# Altium project Project Board Test SOM AM625.PrjPcb (part 6 of 7)

## Sheet JTAG & DEBUG & HEADERS.SchDoc
size A3; DocumentNumber: 10; SheetNumber: 10; SheetTotal: 12
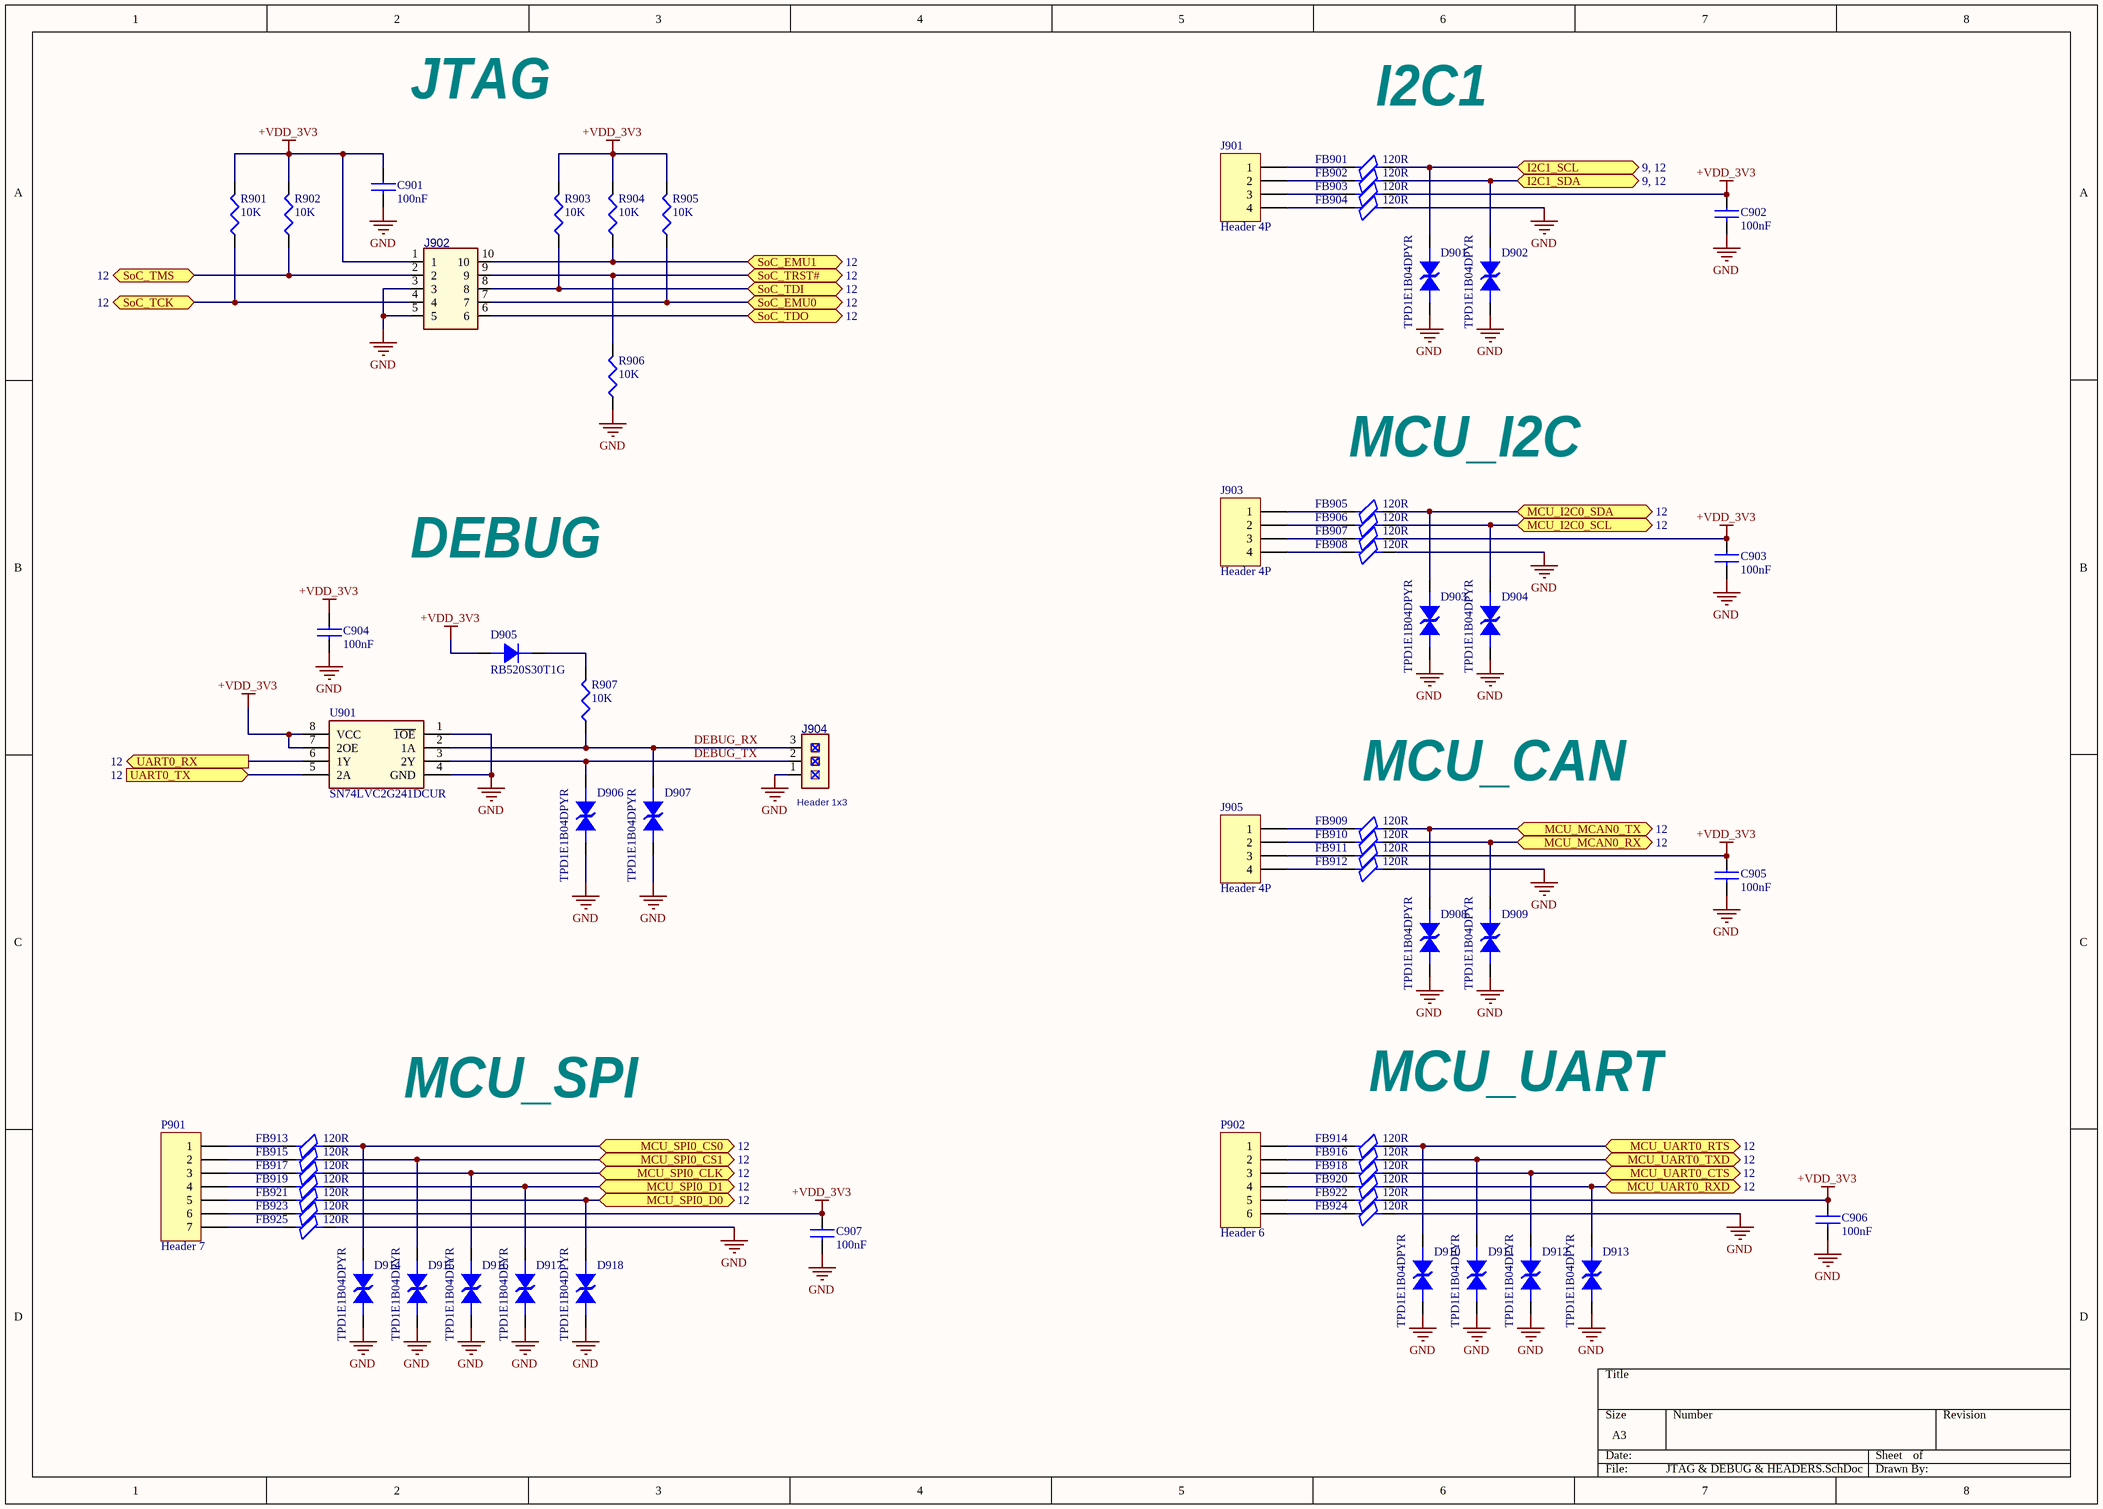
[diagram p6: JTAG & DEBUG & HEADERS.SchDoc]

### Parts
C901  100nF  [C0201]
C902  100nF  [C0201]
C903  100nF  [C0201]
C904  100nF  [C0201]
C905  100nF  [C0201]
C906  100nF  [C0201]
C907  100nF  [C0201]
D901  TPD1E1B04DPYR  [DIO_TPD1E05U06DPYR]
D902  TPD1E1B04DPYR  [DIO_TPD1E05U06DPYR]
D903  TPD1E1B04DPYR  [DIO_TPD1E05U06DPYR]
D904  TPD1E1B04DPYR  [DIO_TPD1E05U06DPYR]
D905  RB520S30T1G  [sod_523]
D906  TPD1E1B04DPYR  [DIO_TPD1E05U06DPYR]
D907  TPD1E1B04DPYR  [DIO_TPD1E05U06DPYR]
D908  TPD1E1B04DPYR  [DIO_TPD1E05U06DPYR]
D909  TPD1E1B04DPYR  [DIO_TPD1E05U06DPYR]
D910  TPD1E1B04DPYR  [DIO_TPD1E05U06DPYR]
D911  TPD1E1B04DPYR  [DIO_TPD1E05U06DPYR]
D912  TPD1E1B04DPYR  [DIO_TPD1E05U06DPYR]
D913  TPD1E1B04DPYR  [DIO_TPD1E05U06DPYR]
D914  TPD1E1B04DPYR  [DIO_TPD1E05U06DPYR]
D915  TPD1E1B04DPYR  [DIO_TPD1E05U06DPYR]
D916  TPD1E1B04DPYR  [DIO_TPD1E05U06DPYR]
D917  TPD1E1B04DPYR  [DIO_TPD1E05U06DPYR]
D918  TPD1E1B04DPYR  [DIO_TPD1E05U06DPYR]
FB901  120R  [FB0402]
FB902  120R  [FB0402]
FB903  120R  [FB0402]
FB904  120R  [FB0402]
FB905  120R  [FB0402]
FB906  120R  [FB0402]
FB907  120R  [FB0402]
FB908  120R  [FB0402]
FB909  120R  [FB0402]
FB910  120R  [FB0402]
FB911  120R  [FB0402]
FB912  120R  [FB0402]
FB913  120R  [FB0402]
FB914  120R  [FB0402]
FB915  120R  [FB0402]
FB916  120R  [FB0402]
FB917  120R  [FB0402]
FB918  120R  [FB0402]
FB919  120R  [FB0402]
FB920  120R  [FB0402]
FB921  120R  [FB0402]
FB922  120R  [FB0402]
FB923  120R  [FB0402]
FB924  120R  [FB0402]
FB925  120R  [FB0402]
J901  Header 4P  [HDR1X4]
J902  Header 2X5_1  [CONNECT10_1D27_12_4X6_7MM]  (value not drawn)
J903  Header 4P  [HDR1X4]
J904  Header 1x3  [HDR1X3]
J905  Header 4P  [HDR1X4]
P901  Header 7  [HDR1X7]
P902  Header 6  [HDR1X6]
R901  10K  [R0402]
R902  10K  [R0402]
R903  10K  [R0402]
R904  10K  [R0402]
R905  10K  [R0402]
R906  10K  [R0402]
R907  10K  [R0402]
U901  SN74LVC2G241DCUR  [DCU8-M]

### Ports
I2C1_SCL (bidir, see 9, 12), I2C1_SDA (bidir, see 9, 12), MCU_I2C0_SCL (bidir, see 12), MCU_I2C0_SDA (bidir, see 12), MCU_MCAN0_RX (bidir, see 12), MCU_MCAN0_TX (bidir, see 12), MCU_SPI0_CLK (bidir, see 12), MCU_SPI0_CS0 (bidir, see 12), MCU_SPI0_CS1 (bidir, see 12), MCU_SPI0_D0 (bidir, see 12), MCU_SPI0_D1 (bidir, see 12), MCU_UART0_CTS (bidir, see 12), MCU_UART0_RTS (bidir, see 12), MCU_UART0_RXD (bidir, see 12), MCU_UART0_TXD (bidir, see 12), SoC_EMU0 (bidir, see 12), SoC_EMU1 (bidir, see 12), SoC_TCK (bidir, see 12), SoC_TDI (bidir, see 12), SoC_TDO (bidir, see 12), SoC_TMS (bidir, see 12), SoC_TRST# (bidir, see 12), UART0_RX (out, see 12), UART0_TX (in, see 12)

### Nets
+VDD_3V3: C901.1 C902.1 C903.1 C904.1 C905.1 C906.1 C907.1 D905.1(A) FB903.2 FB907.2 FB911.2 FB922.2 FB923.2 J902.1 R901.2 R902.2 R903.2 R904.2 R905.2 U901.7(2OE) U901.8(VCC)
GND: C901.2 C902.2 C903.2 C904.2 C905.2 C906.2 C907.2 D901.1 D902.1 D903.1 D904.1 D906.1 D907.1 D908.1 D909.1 D910.1 D911.1 D912.1 D913.1 D914.1 D915.1 D916.1 D917.1 D918.1 FB904.2 FB908.2 FB912.2 FB924.2 FB925.2 J902.3 J902.5 J904.1 R906.1 U901.1(~{1OE}) U901.4(GND)
DEBUG_RX: D907.2 J904.3 R907.1 U901.2(1A)
DEBUG_TX: D906.2 J904.2 U901.3(2Y)
I2C1_SCL: D901.2 FB901.2 ; port I2C1_SCL
I2C1_SDA: D902.2 FB902.2 ; port I2C1_SDA
MCU_I2C0_SCL: D904.2 FB906.2 ; port MCU_I2C0_SCL
MCU_I2C0_SDA: D903.2 FB905.2 ; port MCU_I2C0_SDA
MCU_MCAN0_RX: D909.2 FB910.2 ; port MCU_MCAN0_RX
MCU_MCAN0_TX: D908.2 FB909.2 ; port MCU_MCAN0_TX
MCU_SPI0_CLK: D916.2 FB917.2 ; port MCU_SPI0_CLK
MCU_SPI0_CS0: D914.2 FB913.2 ; port MCU_SPI0_CS0
MCU_SPI0_CS1: D915.2 FB915.2 ; port MCU_SPI0_CS1
MCU_SPI0_D0: D918.2 FB921.2 ; port MCU_SPI0_D0
MCU_SPI0_D1: D917.2 FB919.2 ; port MCU_SPI0_D1
MCU_UART0_CTS: D912.2 FB918.2 ; port MCU_UART0_CTS
MCU_UART0_RTS: D910.2 FB914.2 ; port MCU_UART0_RTS
MCU_UART0_RXD: D913.2 FB920.2 ; port MCU_UART0_RXD
MCU_UART0_TXD: D911.2 FB916.2 ; port MCU_UART0_TXD
SoC_EMU0: J902.7 R905.1 ; port SoC_EMU0
SoC_EMU1: J902.10 R904.1 ; port SoC_EMU1
SoC_TCK: J902.4 R901.1 ; port SoC_TCK
SoC_TDI: J902.8 R903.1 ; port SoC_TDI
SoC_TDO: J902.6 ; port SoC_TDO
SoC_TMS: J902.2 R902.1 ; port SoC_TMS
SoC_TRST#: J902.9 R906.2 ; port SoC_TRST#
UART0_RX: U901.6(1Y) ; port UART0_RX
UART0_TX: U901.5(2A) ; port UART0_TX
NetD905_2: D905.2(C) R907.2
NetFB901_1: FB901.1 J901.1
NetFB902_1: FB902.1 J901.2
NetFB903_1: FB903.1 J901.3
NetFB904_1: FB904.1 J901.4
NetFB905_1: FB905.1 J903.1
NetFB906_1: FB906.1 J903.2
NetFB907_1: FB907.1 J903.3
NetFB908_1: FB908.1 J903.4
NetFB909_1: FB909.1 J905.1
NetFB910_1: FB910.1 J905.2
NetFB911_1: FB911.1 J905.3
NetFB912_1: FB912.1 J905.4
NetFB913_1: FB913.1 P901.1
NetFB914_1: FB914.1 P902.1
NetFB915_1: FB915.1 P901.2
NetFB916_1: FB916.1 P902.2
NetFB917_1: FB917.1 P901.3
NetFB918_1: FB918.1 P902.3
NetFB919_1: FB919.1 P901.4
NetFB920_1: FB920.1 P902.4
NetFB921_1: FB921.1 P901.5
NetFB922_1: FB922.1 P902.5
NetFB923_1: FB923.1 P901.6
NetFB924_1: FB924.1 P902.6
NetFB925_1: FB925.1 P901.7

### Notes on the sheet
- JTAG
- I2C1
- MCU_I2C
- DEBUG
- MCU_CAN
- MCU_SPI
- MCU_UART

### Library data of the parts
C901-C907 = CC0201KRX5R6BB104: as C312-C317 on sheet HDMI; Supplier 1: Future Electronics; Manufacturer Part Number: CC0201KRX5R6BB104; RoHS: Yes; Category: Ceramic Capacitors; Stock 1: 10410000; Pricing 1: 15000=0.0027, 60000=0.0026, 150000=0.0025, 375000=0.0024, 600000=0.0023 (USD); Mount: Surface Mount; Case/Package: 0201; Case Code (Imperial): 0201; Case Code (Metric): 0603; Weight: 6E-06oz; Min Operating Temperature: -55°C; Max Operating Temperature: 85°C; Capacitance: 100nF; Tolerance: 10%; Dielectric: X5R; Packaging: Tape and Reel; Termination: SMD/SMT; Voltage Rating: 10V; Series: CC; Construction: Flat; Length: 0.6mm; Height: 0.3mm; Depth: 0.3mm; Radiation Hardening: No; RoHS Compliant: Yes; Halogen Free: 5694HalogenFree; Lead Free: 5697LeadFree; ComponentLink1URL: https://datasheet.ciiva.com/11587/upy-gphc-x5r-4v-to-50v-12-11587190.pdf?src-supplier=Avnet; ComponentLink1Description: https://datasheet.ciiva.com/11587/upy-gphc-x5r-4v-to-50v-12-11587190.pdf?src-supplier=Avnet; Supplier Part Number 1: 5050553
D901-D904 D906-D918 = TPD1E1B04DPYR: 1-pF, ±3.6-V, ±30-kV ESD protection diode with 6-A 8/20-uS surge & Low Clamping in 0402 package; Manufacturer: Texas Instruments; Capacitance: 1pF; Interface: LVDS,USB,Ethernet; Number of Channels: 1; Direction: 211Direction; Breakdown Voltage: 6.4V; Clamping Voltage: 8.5V; Peak Pulse Current: 6.3A; Peak Pulse Power: 50W; Reverse Standoff Voltage: 3.6V; Supplier 1: Mouser; Manufacturer Part Number: TPD1E1B04DPYR; RoHS: Yes; Category: Integrated Circuits (ICs); Stock 1: 57724; Pricing 1: 1=0.35, 10=0.28, 50=0.28, 100=0.184, 500=0.144, 1000=0.102, 2500=0.098, 10000=0.085, 20000=0.084, 50000=0.079 (USD); Number of Pins: 2NUMBER; Min Operating Temperature: -40°C; Max Operating Temperature: 125°C; Length: 600um; Width: 1mm; Height: 450um; Thickness: 370um; Lead Free: Lead Free; RoHS Compliant: Yes; ComponentLink1URL: http://www.ti.com/lit/ds/symlink/tpd1e1b04.pdf?src-supplier=Digi-Key; ComponentLink1Description: http://www.ti.com/lit/ds/symlink/tpd1e1b04.pdf?src-supplier=Digi-Key; ComponentLink2URL: http://www.ti.com/general/docs/suppproductinfo.tsp?distId=10&amp;gotoUrl=http%3A%2F%2Fwww.ti.com%2Flit%2Fgpn%2Ftpd1e1b04&src-supplier=Digi-Key; ComponentLink2Description: http://www.ti.com/general/docs/suppproductinfo.tsp?distId=10&amp;gotoUrl=http%3A%2F%2Fwww.ti.com%2Flit%2Fgpn%2Ftpd1e1b04&src-supplier=Digi-Key; Supplier Part Number 1: 595-TPD1E1B04DPYR
D905 = RB520S30T1G: Diode Schottky 30V 0.2A 2-Pin SOD-523 T/R - Product that comes on tape, but is not reeled; Manufacturer: ON Semiconductor; Polarity: Standard; Current Rating: 200mA; Element Configuration: Single; Forward Voltage: 600mV; Max Reverse Leakage Current: 1uA; Power Dissipation: 200mW; Supplier 1: Future Electronics; Manufacturer Part Number: RB520S30T1G; RoHS: Yes; Category: Schottky Diodes; Stock 1: 33000; Pricing 1: 3000=0.0155, 12000=0.0148, 45000=0.0143, 90000=0.0139, 225000=0.0133 (USD); Case/Package: SOD-523-2; Number of Pins: 2; Min Operating Temperature: -55°C; Max Operating Temperature: 150°C; Packaging: Tape and Reel; Voltage Rating (DC): 30V; Output Current: 200mA; Max Repetitive Reverse Voltage (Vrrm): 30V; Package Quantity: 3000; Forward Current: 200mA; Average Rectified Current: 200mA; Max Forward Surge Current (Ifsm): 200mA; Max Reverse Current: 1uA; Max Reverse Voltage (DC): 30V; Series: -; Length: 1.3mm; Width: 0.9mm; Height: 0.7mm; Radiation Hardening: No; Reach SVHC Compliant: No; Lead Free: Lead Free; RoHS Compliant: Yes; ComponentLink1URL: https://datasheet.ciiva.com/915/rb520s30t1-d-915377.pdf?src-supplier=Avnet; ComponentLink1Description: https://datasheet.ciiva.com/915/rb520s30t1-d-915377.pdf?src-supplier=Avnet; ComponentLink2URL: https://datasheet.ciiva.com/915/rb520s30t1-d-915377.pdf?src-supplier=Digi-Key; ComponentLink2Description: https://datasheet.ciiva.com/915/rb520s30t1-d-915377.pdf?src-supplier=Digi-Key; ComponentLink3URL: https://datasheet.ciiva.com/22659/1708342-22659126.pdf?src-supplier=Element14; ComponentLink3Description: https://datasheet.ciiva.com/22659/1708342-22659126.pdf?src-supplier=Element14; ComponentLink4URL: https://datasheet.ciiva.com/4715/rb520s30t1-d-101117-4715113.pdf?src-supplier=Mouser; ComponentLink4Description: https://datasheet.ciiva.com/4715/rb520s30t1-d-101117-4715113.pdf?src-supplier=Mouser; ComponentLink5URL: https://datasheet.ciiva.com/16210/rb520s30t1-d-16210917.pdf?src-supplier=Future+Electronics; ComponentLink5Description: https://datasheet.ciiva.com/16210/rb520s30t1-d-16210917.pdf?src-supplier=Future+Electronics; ComponentLink6URL: https://datasheet.ciiva.com/8292/rb520s30t1-d-8292399.pdf?src-supplier=Avnet; ComponentLink6Description: https://datasheet.ciiva.com/8292/rb520s30t1-d-8292399.pdf?src-supplier=Avnet; ComponentLink7URL: https://datasheet.ciiva.com/915/rb520s30t1-d-915378.pdf?src-supplier=Digi-Key; ComponentLink7Description: https://datasheet.ciiva.com/915/rb520s30t1-d-915378.pdf?src-supplier=Digi-Key; ComponentLink8URL: https://datasheet.ciiva.com/915/rb520s30t1-d-915379.pdf?src-supplier=Digi-Key; ComponentLink8Description: https://datasheet.ciiva.com/915/rb520s30t1-d-915379.pdf?src-supplier=Digi-Key; Supplier Part Number 1: 7657109
FB901-FB925 = BLM15PD121SZ1D: as FB301-FB306 on sheet HDMI; Supplier 1: Arrow Electronics; Manufacturer Part Number: BLM15PD121SZ1D; RoHS: Yes; Category: Ferrite Beads and Chips; Stock 1: 10000; Pricing 1: 10000=0.0178, 20000=0.0168, 30000=0.016, 50000=0.0158 (USD); Mount: Surface Mount; Case/Package: 0402; Case Code (Imperial): 0402; Case Code (Metric): 1005; Min Operating Temperature: -55°C; Max Operating Temperature: 125°C; Packaging: Cut Tape; Max Current Rating: 1.3A; Series: EMIFIL®, BLM15; RMS Current (Irms): 1.3A; Series Resistance: 90mR; Test Frequency: 100MHz; Tolerance: 25%; Height: 550um; Ratings: AEC-Q200; RoHS Compliant: Yes; ComponentLink1URL: https://www.murata.com/en-us/products/productdata/8796748677150/QNFA9118.pdf?src-supplier=Digi-Key; ComponentLink1Description: https://www.murata.com/en-us/products/productdata/8796748677150/QNFA9118.pdf?src-supplier=Digi-Key; Supplier Part Number 1: BLM15PD121SZ1D
J901 J903 J905 = Header 4x1: Header, 4 Pin Pitch 2.54mm; MPN: S1012EC-40-ND; CompanyID: VT-00125; Solder: WAVE; Value: Header 4P
P901 = Header 7x1: Header, 7-Pin, 2.54mm; Solder: WAVE
P902 = Header 6x1: Header, 6-Pin; Solder: WAVE
R901-R907 = RC0402FR-0710KL: RES 10.0K OHM 1/16W 1% 0402 SMD; Manufacturer: Yageo; Power (Watts): 0.063W, 1/16W; .Checked PCB: used; Temperature Coefficient: ±100ppm/°C; Category: Resistors; Supplier Part Number: 311-10.0KLRCT-ND; Manufacturer Part Number: RC0402FR-0710KL; Package / Case: 0402 (1005 Metric); Price 1k [$]: 0.01421; Resistance (Ohms): 10K; Tolerance: ±1%; Value: 10k; .Checked SCH: used; Supplier: Digikey; Supplier 1: Digi-Key; Supplier Part Number 1: 311-10.0KLRCT-ND; RoHS: RoHS Compliant; Stock 1: 2916495; Pricing 1: 10=0.014, 50=0.0104, 100=0.0079, 250=0.00584, 500=0.00432, 1000=0.00288 (USD); Composition: Thick Film; Features: -; Size / Dimension: 0.039" L x 0.020" W (1.00mm x 0.50mm); Height: 0.016" (0.40mm); Number of Terminations: 2; Packaging: Cut Tape (CT); ComponentLink1URL: http://www.yageo.com/documents/recent/PYu-RC0402_51_RoHS_L_6.pdf; ComponentLink1Description: http://www.yageo.com/documents/recent/PYu-RC0402_51_RoHS_L_6.pdf
U901 = SN74LVC2G241DCUR: Buffer, Non-Inverting 2 Element 1 Bit per Element Push-Pull Output US8; Manufacturer: Texas Instruments; Supplier 1: Mouser; Manufacturer Part Number: SN74LVC2G241DCUR; RoHS: Yes; Category: Buffers, Drivers and Transceivers; Stock 1: 7164; Pricing 1: 1=0.57, 10=0.473, 50=0.473, 100=0.355, 1000=0.23, 10000=0.182 (USD); ComponentLink1URL: https://datasheet.ciiva.com/15095/getdatasheetpartid-196853-15095029.pdf?src-supplier=Verical; ComponentLink1Description: https://datasheet.ciiva.com/15095/getdatasheetpartid-196853-15095029.pdf?src-supplier=Verical; ComponentLink2URL: https://datasheet.ciiva.com/1833/sn74lvc2g241-1833955.pdf?src-supplier=Digi-Key; ComponentLink2Description: https://datasheet.ciiva.com/1833/sn74lvc2g241-1833955.pdf?src-supplier=Digi-Key; ComponentLink3URL: https://datasheet.ciiva.com/1833/sn74lvc2g241-1833956.pdf?src-supplier=Digi-Key; ComponentLink3Description: https://datasheet.ciiva.com/1833/sn74lvc2g241-1833956.pdf?src-supplier=Digi-Key; ComponentLink4URL: https://datasheet.ciiva.com/1833/sn74lvc2g241-1833957.pdf?src-supplier=Digi-Key; ComponentLink4Description: https://datasheet.ciiva.com/1833/sn74lvc2g241-1833957.pdf?src-supplier=Digi-Key; ComponentLink5URL: https://datasheet.ciiva.com/48702/001073977-da-01-en-ic-buff-dvr-tr-sn74lvc2g241dcur-us-8-tid-48702679.pdf?src-supplier=Conrad; ComponentLink5Description: https://datasheet.ciiva.com/48702/001073977-da-01-en-ic-buff-dvr-tr-sn74lvc2g241dcur-us-8-tid-48702679.pdf?src-supplier=Conrad; Supplier Part Number 1: 595-SN74LVC2G241DCUR

## Sheet BUTTONS&LEDS.SchDoc
size A4; DocumentNumber: 11; SheetNumber: 11; SheetTotal: 12
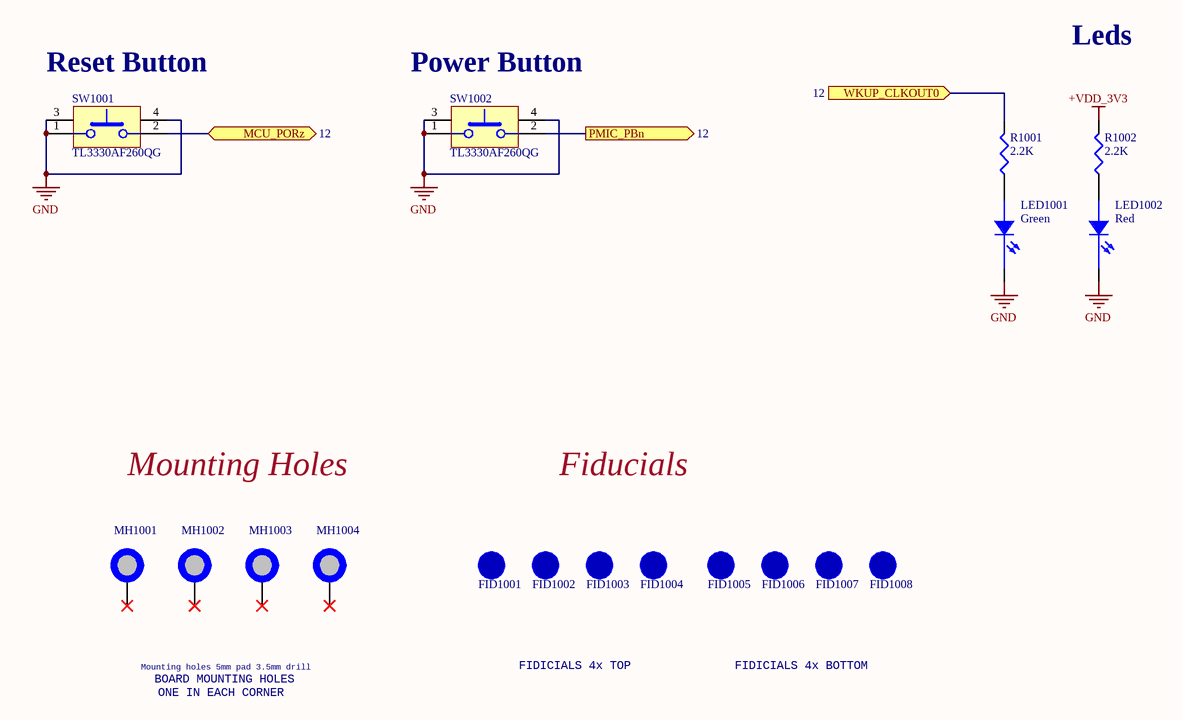
[diagram p7: BUTTONS&LEDS.SchDoc]

### Parts
FID1001  FID_1MMC  [FID_40X120D]  (value not drawn)  (no BOM)
FID1002  FID_1MMC  [FID_40X120D]  (value not drawn)  (no BOM)
FID1003  FID_1MMC  [FID_40X120D]  (value not drawn)  (no BOM)
FID1004  FID_1MMC  [FID_40X120D]  (value not drawn)  (no BOM)
FID1005  FID_1MMC  [FID_40X120D]  (value not drawn)  (no BOM)
FID1006  FID_1MMC  [FID_40X120D]  (value not drawn)  (no BOM)
FID1007  FID_1MMC  [FID_40X120D]  (value not drawn)  (no BOM)
FID1008  FID_1MMC  [FID_40X120D]  (value not drawn)  (no BOM)
LED1001  Green  [led0402_G]
LED1002  Red  [led0402_R]
MH1001  MH_5MMD_3.5MMH  [MH_5MMD_3.5MMH]  (value not drawn)
MH1002  MH_5MMD_3.5MMH  [MH_5MMD_3.5MMH]  (value not drawn)
MH1003  MH_5MMD_3.5MMH  [MH_5MMD_3.5MMH]  (value not drawn)
MH1004  MH_5MMD_3.5MMH  [MH_5MMD_3.5MMH]  (value not drawn)
R1001  2.2K  [R0402]
R1002  2.2K  [R0402]
SW1001  TL3330AF260QG  [SW_TL3330_EWI]
SW1002  TL3330AF260QG  [SW_TL3330_EWI]

### Ports
MCU_PORz (bidir, see 12), PMIC_PBn (out, see 12), WKUP_CLKOUT0 (in, see 12)

### Nets
+VDD_3V3: R1002.2
GND: LED1001.2(C) LED1002.2(C) SW1001.1 SW1001.3(MECH1) SW1001.4(MECH2) SW1002.1 SW1002.3(MECH1) SW1002.4(MECH2)
MCU_PORz: SW1001.2 ; port MCU_PORz
PMIC_PBn: SW1002.2 ; port PMIC_PBn
WKUP_CLKOUT0: R1001.2 ; port WKUP_CLKOUT0
NetLED1001_1: LED1001.1(A) R1001.1
NetLED1002_1: LED1002.1(A) R1002.1

Not connected (* = marked no-connect by the designer): MH1001 1*; MH1002 1*; MH1003 1*; MH1004 1*

### Notes on the sheet
- (near SW1001) Reset Button
- (near SW1002) Power Button
- Leds
- Mounting Holes
- Fiducials
- Mounting holes 5mm pad 3.5mm drill
- BOARD MOUNTING HOLES
- ONE IN EACH CORNER
- FIDICIALS 4x TOP
- FIDICIALS 4x BOTTOM

### Library data of the parts
FID1001-FID1008 = FID_1MMC: Fiducial 40mil Diameter, 120mil Mask; Supplier: Digikey
LED1001 = BL-HGE37A-AV-TRB: Yellow Green 0402 1X.5X4MM; Manufacturer: American Bright; Supplier 1: Digi-Key; Manufacturer Part Number: BL-HGE37A-AV-TRB; RoHS: Yes; Category: LEDs; Stock 1: 34287; Pricing 1: 1=0.34, 10=0.268, 100=0.1202, 500=0.1086, 1000=0.0892 (USD); ComponentLink1URL: http://americanbrightled.com/pdffiles/smt/BL-HGE37A-AV-TRB.pdf?src-supplier=Digi-Key; ComponentLink1Description: http://americanbrightled.com/pdffiles/smt/BL-HGE37A-AV-TRB.pdf?src-supplier=Digi-Key; ComponentLink2URL: http://www.americanbrightled.com/pdffiles/smt/BL-HGE37A-AV-TRB.pdf?src-supplier=Digi-Key; ComponentLink2Description: http://www.americanbrightled.com/pdffiles/smt/BL-HGE37A-AV-TRB.pdf?src-supplier=Digi-Key; Supplier Part Number 1: BL-HGE37A-AV-TRBCT-ND
LED1002 = SML-P12U2TT86R: LED Uni-Color Red 2-Pin Chip 0402(1006Metric) T/R; Manufacturer: Rohm; Supplier 1: Digi-Key; Manufacturer Part Number: SML-P12U2TT86R; RoHS: Yes; Category: LEDs; Stock 1: 17913; Pricing 1: 1=0.36, 10=0.236, 100=0.1577, 500=0.10908, 1000=0.0909, 2000=0.08181 (USD); ComponentLink1URL: http://www.mouser.com/ds/2/348/sml-p1-471200.pdf?src-supplier=Mouser; ComponentLink1Description: http://www.mouser.com/ds/2/348/sml-p1-471200.pdf?src-supplier=Mouser; ComponentLink2URL: https://datasheet.octopart.com/SML-P12U2TT86R-Rohm-datasheet-138791994.pdf?src-supplier=Future+Electronics; ComponentLink2Description: https://datasheet.octopart.com/SML-P12U2TT86R-Rohm-datasheet-138791994.pdf?src-supplier=Future+Electronics; ComponentLink3URL: https://www.rohm.com/datasheet/SML-P12DT(R)?src-supplier=Digi-Key; ComponentLink3Description: https://www.rohm.com/datasheet/SML-P12DT(R)?src-supplier=Digi-Key; ComponentLink4URL: https://d1d2qsbl8m0m72.cloudfront.net/en/products/databook/datasheet/opto/led/chip_mono/sml-p1-e.pdf?src-supplier=Digi-Key; ComponentLink4Description: https://d1d2qsbl8m0m72.cloudfront.net/en/products/databook/datasheet/opto/led/chip_mono/sml-p1-e.pdf?src-supplier=Digi-Key; Supplier Part Number 1: 846-1192-1-ND
MH1001-MH1004 = MH_5MMD_3.5MMH: Mounting Hole 5mm Diameter, 3.5mm Hole
R1001 R1002 = RC0402FR-072K2L: SMD Chip Resistor, 2.2 kOhm, ± 1%, 63 mW, 0402 [1005 Metric], Thick Film, General Purpose; Manufacturer: Yageo; Resistance: 2.2kR; Power Rating: 62.5mW; Voltage Rating: 50V; Temperature Coefficient: 100ppm/°C; Max Power Dissipation: 63mW; Supplier 1: Future Electronics; Manufacturer Part Number: RC0402FR-072K2L; RoHS: Yes; Category: Chip SMD Resistors; Stock 1: 70000; Pricing 1: 10000=0.0008, 50000=0.0008, 250000=0.0007, 500000=0.0007, 1500000=0.0007 (USD); Case/Package: 0402; Case Code (Imperial): 0402; Case Code (Metric): 1005; Weight: 2.3E-05oz; Size Code: 0402; Min Operating Temperature: -55°C; Max Operating Temperature: 155°C; Resistor Type: Thick Film; Packaging: Tape and Reel; Tolerance: 1%; Termination: SMD/SMT; Features: Moisture Resistant; Series: RC; Number of Terminations: 2; Resistance Tolerance: 1%; Construction: Rectangular; Technology: THICK FILM; Voltage Rating (AC): 50V; Length: 1mm; Width: 0.5mm; Height: 0.35mm; Depth: 0.5mm; RoHS Compliant: Yes; Reach SVHC Compliant: No; Military Standard: Not; Lead Free: Lead Free; ComponentLink1URL: https://datasheet.ciiva.com/11808/0900766b80c66297-11808786.pdf?src-supplier=Rs; ComponentLink1Description: https://datasheet.ciiva.com/11808/0900766b80c66297-11808786.pdf?src-supplier=Rs; ComponentLink2URL: https://datasheet.ciiva.com/7983/1018594-7983515.pdf?src-supplier=Element14; ComponentLink2Description: https://datasheet.ciiva.com/7983/1018594-7983515.pdf?src-supplier=Element14; ComponentLink3URL: https://datasheet.ciiva.com/46383/1018594-46383563.pdf?src-supplier=Element14; ComponentLink3Description: https://datasheet.ciiva.com/46383/1018594-46383563.pdf?src-supplier=Element14; ComponentLink4URL: https://datasheet.ciiva.com/12577/pyu-rc0402-51-rohs-l-6-r-12577429.pdf?src-supplier=Mouser; ComponentLink4Description: https://datasheet.ciiva.com/12577/pyu-rc0402-51-rohs-l-6-r-12577429.pdf?src-supplier=Mouser; ComponentLink5URL: https://datasheet.ciiva.com/7849/1018594-7849929.pdf?src-supplier=Element14; ComponentLink5Description: https://datasheet.ciiva.com/7849/1018594-7849929.pdf?src-supplier=Element14; ComponentLink6URL: https://datasheet.ciiva.com/7849/1018594-7849928.pdf?src-supplier=Element14; ComponentLink6Description: https://datasheet.ciiva.com/7849/1018594-7849928.pdf?src-supplier=Element14; ComponentLink7URL: https://datasheet.ciiva.com/16741/pyu-rc0402-51-rohs-l-6-r-16741015.pdf?src-supplier=Future+Electronics; ComponentLink7Description: https://datasheet.ciiva.com/16741/pyu-rc0402-51-rohs-l-6-r-16741015.pdf?src-supplier=Future+Electronics; Supplier Part Number 1: 6626931
SW1001 SW1002 = TL3330AF260QG: Switch Tactile N.O. SPST Rectangular Button Gull Wing 0.05A 12VDC 2.55N SMD; Manufacturer: E-Switch; Contact Current Rating: 50mA; Number of Positions: 2NUMBER; Supplier 1: Digikey; Manufacturer Part Number: TL3330AF260QG; RoHS: Yes; Category: Tactile Switches; Stock 1: 112482; Pricing 1: 1=0.51, 10=0.488, 25=0.47, 100=0.4068, 250=0.3706, 500=0.3435, 1000=0.30734 (USD); Height: 3.75mm; ComponentLink1URL: https://datasheet.ciiva.com/2900/p010951-2900788.pdf?src-supplier=Digikey; ComponentLink1Description: https://datasheet.ciiva.com/2900/p010951-2900788.pdf?src-supplier=Digikey; ComponentLink2URL: https://datasheet.ciiva.com/5284/tl3330-28043-5284129.pdf?src-supplier=Mouser; ComponentLink2Description: https://datasheet.ciiva.com/5284/tl3330-28043-5284129.pdf?src-supplier=Mouser; ComponentLink3URL: https://datasheet.ciiva.com/2900/tl3330-2900789.pdf?src-supplier=Digikey; ComponentLink3Description: https://datasheet.ciiva.com/2900/tl3330-2900789.pdf?src-supplier=Digikey; ComponentLink4URL: https://datasheet.ciiva.com/2900/tl3330-2900790.pdf?src-supplier=Digikey; ComponentLink4Description: https://datasheet.ciiva.com/2900/tl3330-2900790.pdf?src-supplier=Digikey; Supplier Part Number 1: EG4389CT-ND